# EAGLE design xjalad_arduino_v1.5 (EAGLE 6.4)
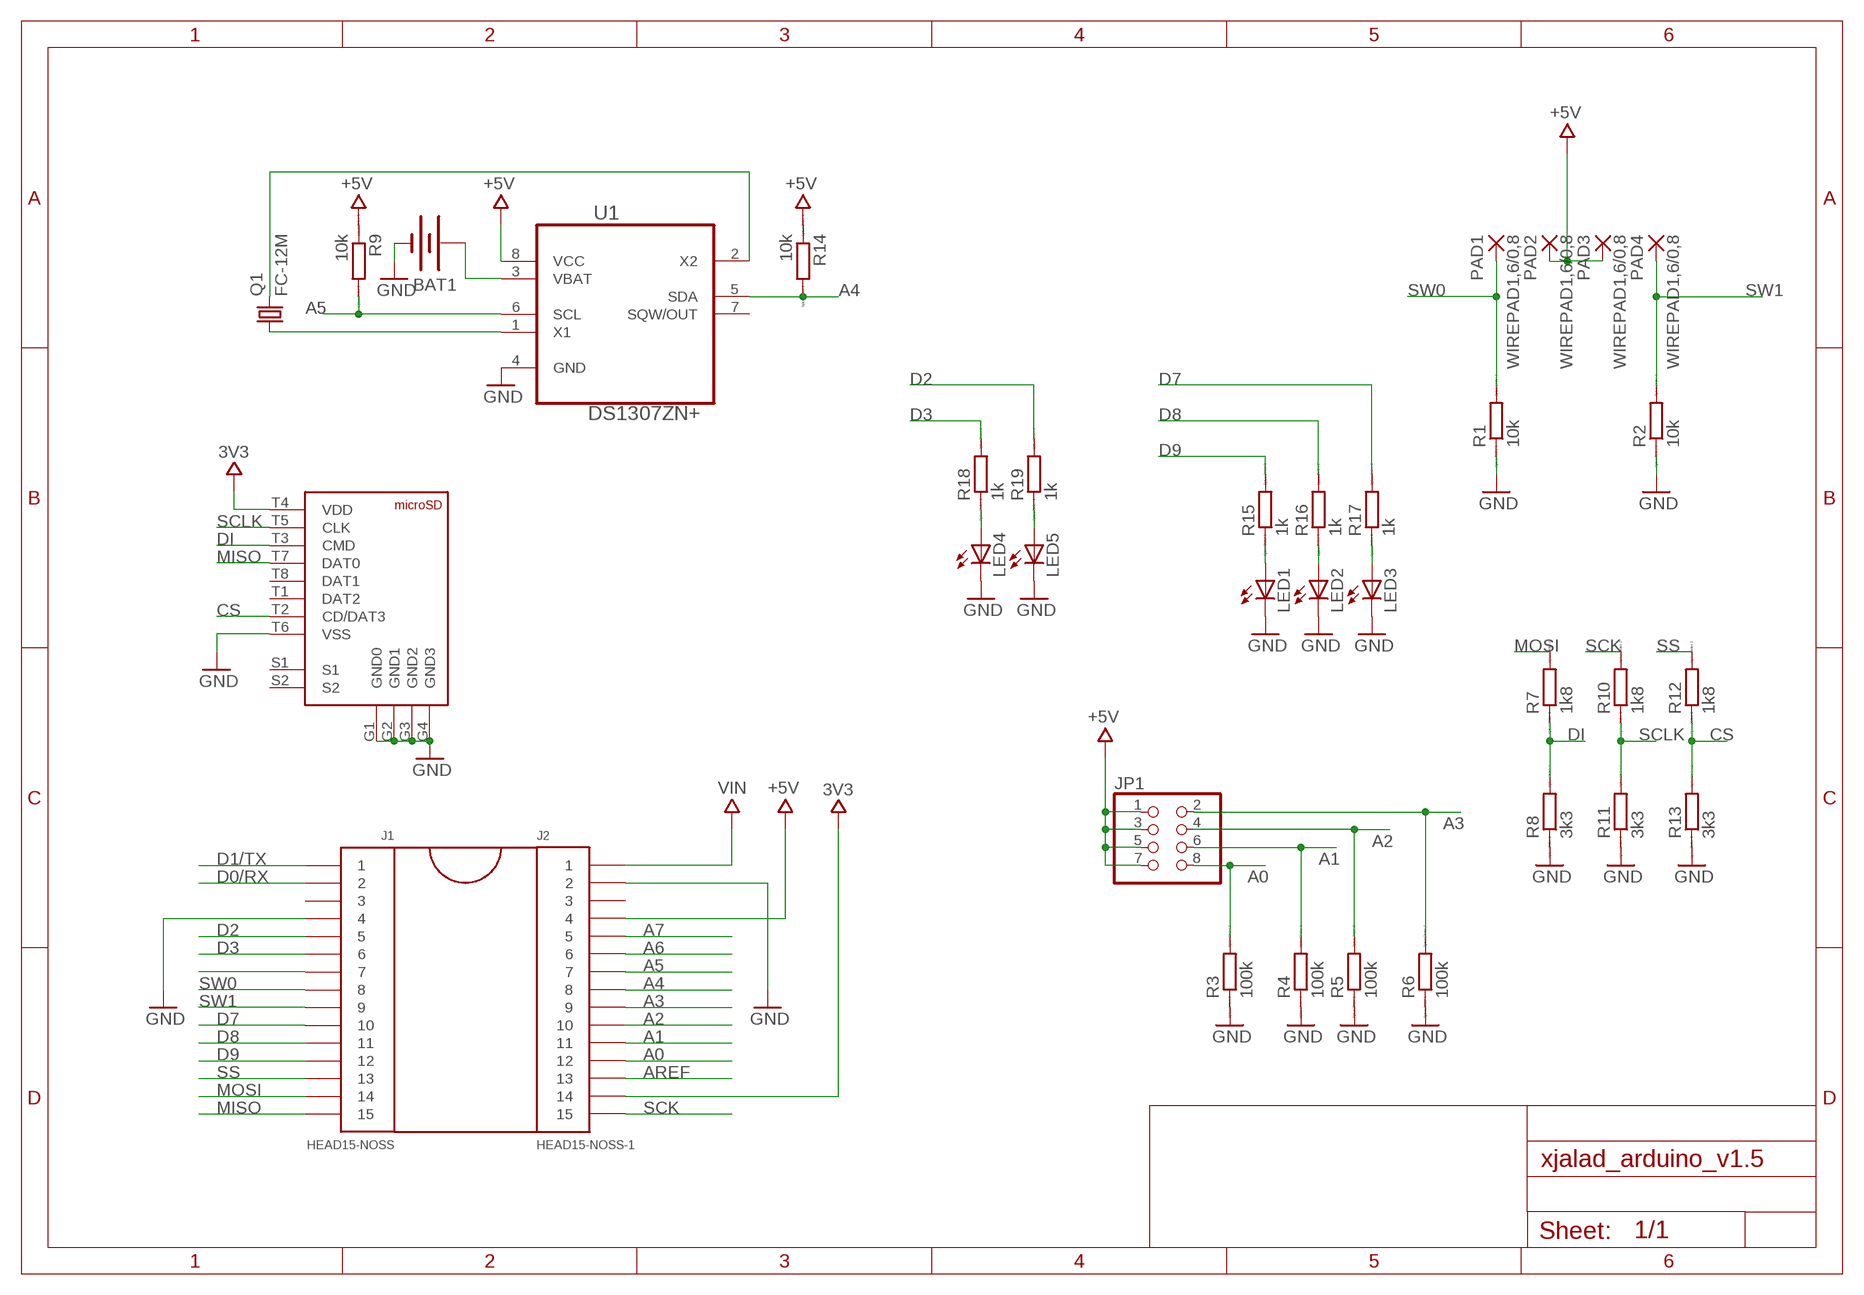
[diagram p0: schematic, sheet 1]

## Parts
BAT1  BATTERY12MM  [BATTCON_12MM]
J1  HEAD15-NOSS  [HEAD15-NOSS]
J2  HEAD15-NOSS-1  [HEAD15-NOSS-1]
J3  MICROSD_MOLEX  [MICROSD_104031]
JP1  PINHD-2X4  [2X04]
LED1  LED0603  [LED-0603]
LED2  LED0603  [LED-0603]
LED3  LED0603  [LED-0603]
LED4  LED0603  [LED-0603]
LED5  LED0603  [LED-0603]
PAD1  WIREPAD1,6/0,8  [1,6/0,8]
PAD2  WIREPAD1,6/0,8  [1,6/0,8]
PAD3  WIREPAD1,6/0,8  [1,6/0,8]
PAD4  WIREPAD1,6/0,8  [1,6/0,8]
Q1  FC-12M  [FC-12M]
R1  10k  RR0603  [R0603]
R2  10k  RR0603  [R0603]
R3  100k  RR0603  [R0603]
R4  100k  RR0603  [R0603]
R5  100k  RR0603  [R0603]
R6  100k  RR0603  [R0603]
R7  1k8  RR0603  [R0603]
R8  3k3  RR0603  [R0603]
R9  10k  RR0603  [R0603]
R10  1k8  RR0603  [R0603]
R11  3k3  RR0603  [R0603]
R12  1k8  RR0603  [R0603]
R13  3k3  RR0603  [R0603]
R14  10k  RR0603  [R0603]
R15  1k  RR0603  [R0603]
R16  1k  RR0603  [R0603]
R17  1k  RR0603  [R0603]
R18  1k  RR0603  [R0603]
R19  1k  RR0603  [R0603]
U1  DS1307ZN+  [SOIC127P600X175-8N]

## Nets
3V3: J2.14 J3.T4(VDD)
+5V: J2.4 JP1.1 JP1.3 JP1.5 JP1.7 PAD2.1(P) PAD3.1(P) R9.1 R14.1 U1.8(VCC)
A0: J2.12 JP1.8 R3.2
A1: J2.11 JP1.6 R4.2
A2: J2.10 JP1.4 R5.2
A3: J2.9 JP1.2 R6.2
A4: J2.8 R14.2 U1.5(SDA)
A5: J2.7 R9.2 U1.6(SCL)
A6: J2.6
A7: J2.5
AREF: J2.13
CS: J3.T2(CD/DAT3) R12.1 R13.2
D0/RX: J1.2
D1/TX: J1.1
D2: J1.5 R19.2
D3: J1.6 R18.2
D7: J1.10 R17.2
D8: J1.11 R16.2
D9: J1.12 R15.2
DI: J3.T3(CMD) R7.1 R8.2
GND: BAT1.GND(-) J1.4 J2.2 J3.G1(GND0) J3.G2(GND1) J3.G3(GND2) J3.G4(GND3) J3.T6(VSS) LED1.C LED2.C LED3.C LED4.C LED5.C R1.1 R2.1 R3.1 R4.1 R5.1 R6.1 R8.1 R11.1 R13.1 U1.4(GND)
MISO: J1.15 J3.T7(DAT0)
MOSI: J1.14 R7.2
N$1: Q1.1 U1.1(X1)
N$2: Q1.2 U1.2(X2)
N$3: LED1.A R15.1
N$4: BAT1.PWR@1(+) U1.3(VBAT)
N$5: LED2.A R16.1
N$6: LED3.A R17.1
N$7: LED4.A R18.1
N$8: LED5.A R19.1
N$11: J1.7
SCK: J2.15 R10.2
SCLK: J3.T5(CLK) R10.1 R11.2
SS: J1.13 R12.2
SW0: J1.8 PAD1.1(P) R1.2
SW1: J1.9 PAD4.1(P) R2.2
VIN: J2.1
Unconnected: J1.3 J2.3 J3.S1 J3.S2 J3.T1(DAT2) J3.T8(DAT1) U1.7(SQW/OUT)

## Library data of the parts
BAT1 = SparkFun:BATTERY: Battery Holders Various common sizes : AA, AAA, 20mm coin cell and 12mm coin cell.
J1 = MyCON2:HEAD15-NOSS
J2 = MyCON2:HEAD15-NOSS-1
J3 = NJC:MICROSD_MOLEX: Mouser Part #: 538-104031-0811 Manufacturer Part #: 104031-0811 Manufacturer: Molex Description: Memory Card Connectors MICRO SD PUSH-PULL SMT 1.42MM HEIGHT
JP1 = pinhead:PINHD-2X4: PIN HEADER
LED1-LED5 = SparkFun:LED: LEDs Standard schematic elements and footprints for 5mm, 3mm, 1206, and 0603 sized LEDs. 5mm - Spark Fun Electronics SKU : COM-00529 (and others)
PAD1-PAD4 = wirepad:WIREPAD: Wire PAD connect wire on PCB
Q1 = crystal:FC-12M: kHz RANGE CRYSTAL UNIT LOW PROFILE SMD Source: Epson Toyocom FC-12M.pdf
R1-R19 = eagle-ltspice:R: RESISTOR, European symbol; SPICEMODEL: NONE; SPICEPREFIX: R
U1 = soic8_max:DS1307ZN+: 64 x 8, Serial, I2C Real-Time Clock; MPN: DS1307ZN+; OC_FARNELL: 9725253; OC_NEWARK: 73J0081; PACKAGE: SOIC-8; SUPPLIER: Maxim

## Board
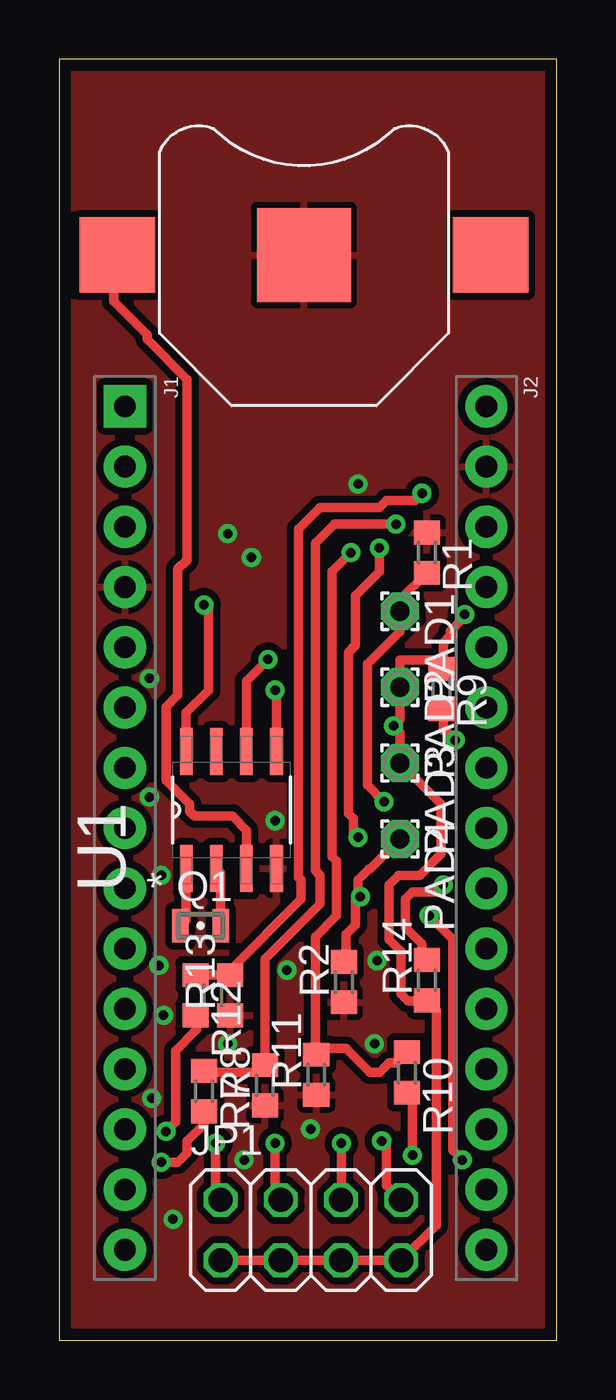
[diagram p1: board, top side]
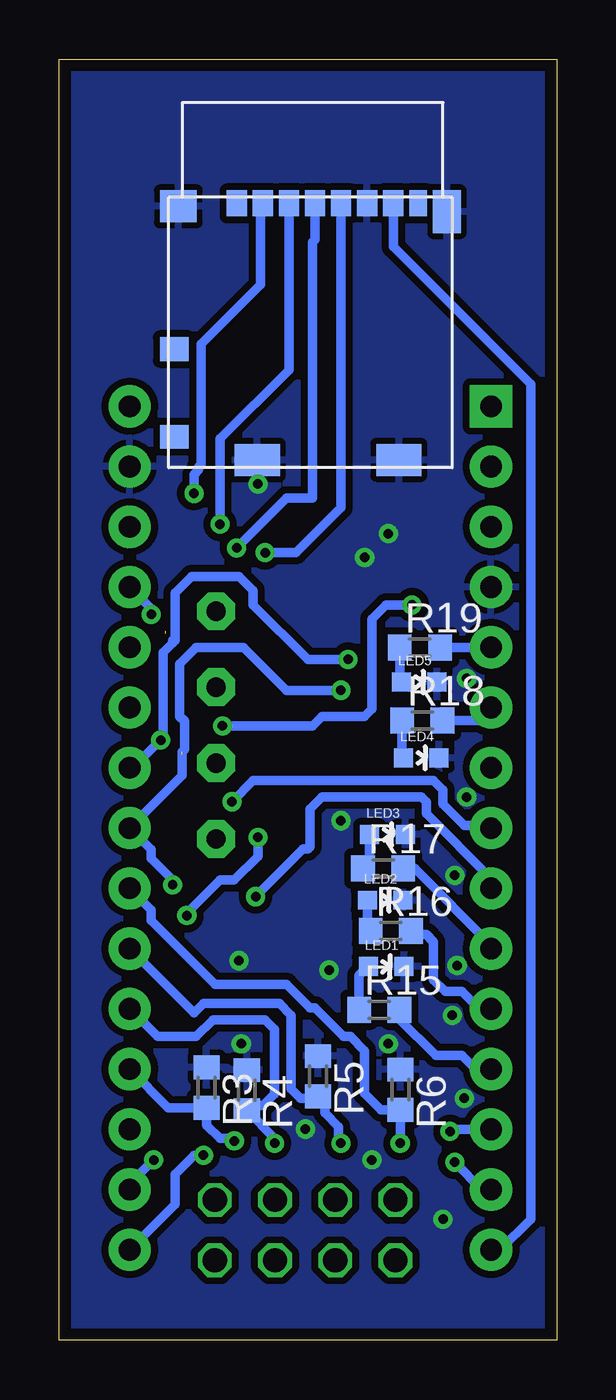
[diagram p2: board, bottom side, seen from below]

Size 20.98 x 54 mm. Coordinates in mm from the lower left corner, seen from the top.
Outline: 0,0 20.98,0 20.98,54 0,54 0,0
Copper layers (1*16): Top 0.035mm / dielectric 1.6mm / Bottom 0.035mm
Design rules "t2he_frees2 *": minimum track width 0.3mm, minimum drill 0.5mm, track to track 0.3mm, track to pad 0.3mm, pad to pad 0.3mm, via to via 0.3mm, smd to smd 0mil, copper to edge 0.5mm, drill to drill 0.5mm, minimum pad ring 8mil, minimum via ring 8mil, stop-mask expansion 4mil, vias tented up to drill 0mil, thermal gap 10mil

### Footprints (pad centres in the part's own frame; a part is rotated, then mirrored left to right if it is on the bottom)
BATTCON_12MM = smd 3.962 x 3.962: GND 0,0 | smd 3.175 x 3.175: PWR@1 -7.874,0; PWR@2 7.874,0
HEAD15-NOSS = drill 0.914 pad 1.778 square: 1 0,0 | drill 0.914 pad 1.778: 2 2.54,0; 3 5.08,0; 4 7.62,0; 5 10.16,0; 6 12.7,0; 7 15.24,0; 8 17.78,0; 9 20.32,0; 10 22.86,0; 11 25.4,0; 12 27.94,0; 13 30.48,0; 14 33.02,0; 15 35.56,0
HEAD15-NOSS-1 = drill 0.914 pad 1.778: 1 0,0; 2 2.54,0; 3 5.08,0; 4 7.62,0; 5 10.16,0; 6 12.7,0; 7 15.24,0; 8 17.78,0; 9 20.32,0; 10 22.86,0; 11 25.4,0; 12 27.94,0; 13 30.48,0; 14 33.02,0; 15 35.56,0
MICROSD_104031 = smd 1.55 x 1.35: G1 5.565,0.375 | smd 1.17 x 1.8: G2 -5.755,0.6 | smd 1.9 x 1.35: G3 -3.73,11.075; G4 2.24,11.075 | smd 1.2 x 1: S1 5.74,10.1; S2 5.74,6.4 | smd 0.85 x 1.1: T1 3.105,0.25; T2 2.005,0.25; T3 0.905,0.25; T4 -0.195,0.25; T5 -1.295,0.25; T6 -2.395,0.25; T7 -3.495,0.25 | smd 0.75 x 1.1: T8 -4.545,0.25
2X04 = drill 1.016 octagon: 1 -3.81,-1.27; 2 -3.81,1.27; 3 -1.27,-1.27; 4 -1.27,1.27; 5 1.27,-1.27; 6 1.27,1.27; 7 3.81,-1.27; 8 3.81,1.27
LED-0603 = smd 0.8 x 0.8: A 0,-0.75; C 0,0.75
1,6/0,8 = drill 0.813 pad 1.6 octagon: 1 0,0
FC-12M = smd 0.7 x 1.4: 1 -0.85,0; 2 0.85,0
R0603 = smd 1 x 1.1: 1 -0.85,0; 2 0.85,0
SOIC127P600X175-8N = smd 1.981 x 0.533: 1 -2.464,1.905; 2 -2.464,0.635; 3 -2.464,-0.635; 4 -2.464,-1.905; 5 2.464,-1.905; 6 2.464,-0.635; 7 2.464,0.635; 8 2.464,1.905

### Placement (x,y rotation side)
BAT1  10.32,45.75 0 top
J1  2.77,39.37 270 top
J2  18.01,39.37 270 top
J3  10.39,48.18 180 bottom
JP1  10.61,4.64 0 top
LED1  7.2,15.75 270 bottom
LED2  7.24,18.55 270 bottom
LED3  7.14,21.32 270 bottom
LED4  5.71,24.55 270 bottom
LED5  5.8,27.75 270 bottom
PAD1  14.37,30.73 270 top
PAD2  14.37,27.53 270 top
PAD3  14.37,24.33 270 top
PAD4  14.37,21.13 270 top
Q1  5.96,17.48 0 top
R1  15.5,33.2 270 top
R2  12,15.1 90 top
R3  14.76,10.65 270 bottom
R4  13.07,10.54 270 bottom
R5  10.06,11.13 270 bottom
R6  6.59,10.56 270 bottom
R7  6.11,10.5 270 top
R8  8.67,10.75 90 top
R9  16.11,27.46 270 top
R10  14.67,11.29 270 top
R11  10.84,11.19 90 top
R12  5.75,14.54 270 top
R13  7.2,14.54 90 top
R14  15.5,15.18 90 top
R15  7.48,13.93 0 bottom
R16  7,17.25 0 bottom
R17  7.32,19.89 0 bottom
R18  5.67,26.12 0 bottom
R19  5.77,29.2 0 bottom
U1  7.26,22.35 90 top

### Tracks (layer width: path | path; a pad name or v marks a point on that pad's centre or on a via)
3V3  (via drill 0.4 pad 0.3)
  Top 0.4: v13.5,33.4 13.5,32.4 12.5,31.4 12.5,29.3 12.2,29 12.2,22.2 12.4,22 12.4,21.4 v12.6,21.2 | v17,7.6 16.6,8 16.6,16.9 v15.6,17.9
  Bottom 0.4: J3.T4 10.2,46.41 10.3,46.3 10.3,35.5 11.4,35.5 v13.5,33.4 | v12.6,21.2 12.6,20.4 13.6,19.4 14.2,19.4 15.6,18 v15.6,17.9 | J2.14 18.01,6.59 v17,7.6
+5V  (via drill 0.4 pad 0.3)  (1 unrouted)
  Top 0.4: JP1.1 JP1.3 JP1.5 JP1.7 15.9,4.85 15.9,13.93 R14.1 15.47,14.3 14.7,14.3 14.4,14.6 14.4,16.4 13.9,16.9 13.9,19.2 14.3,19.6 15.2,19.6 16.1,20.5 16.1,22.6 PAD3.1 14.37,25.63 v14.1,25.9 14.37,26.17 PAD2.1 14.37,28.67 16.07,28.67 16.2,28.8 | v17.1,30.6 17.1,30.5 16.5,29.9 | 16.2,28.8 16.2,29.4 16.5,29.7 16.5,29.8 | 16.2,28.8 16.2,28.4 R9.1 | v6.1,31 6.3,30.8 6.3,27.4 5.36,26.45 U1.8
  Bottom 0.4: v17.1,30.6 17.1,30.84 J2.4 | v6.1,31 7.2,31 7.8,30.4 7.8,26.6 8.1,26.3 9.9,26.3 10.3,25.9 v14.1,25.9
A0  (via drill 0.4 pad 0.3)
  Top 0.4: JP1.8 13.8,6.53 13.8,8.2 v13.6,8.4
  Bottom 0.4: J2.12 16.38,9.8 R3.2 14.76,9.06 14.2,8.5 13.7,8.5 v13.6,8.4
A1  (via drill 0.4 pad 0.3)
  Top 0.4: v11.9,8.3 11.9,5.93 JP1.6
  Bottom 0.4: v11.9,8.3 11.87,8.33 11.87,8.49 R4.2 12.86,9.9 12.38,9.9 11.9,10.38 11.9,13.1 12.3,13.5 14.5,13.5 15.2,12.8 16.84,12.8 J2.11
A2  (via drill 0.4 pad 0.3)
  Top 0.4: v9.1,8.3 9.1,6.15 JP1.4
  Bottom 0.4: 9.16,8.36 v9.1,8.3 9.2,8.4 9.2,9 9.78,9.58 9.78,10.2 10.14,10.2 | J2.10 15.3,13.8 14.9,14.2 11.7,14.2 11.2,13.7 11.2,10.6 10.8,10.2 10.6,10.2 10.14,10.2 | 10.14,10.2 R5.2
A3  (via drill 0.4 pad 0.3)
  Top 0.4: v6.6,8.3 6.6,6.11 JP1.2
  Bottom 0.4: v6.6,8.3 v6.59,8.31 R6.2 7.41,9.71 8.1,10.4 8.1,12.2 8.7,12.8 9,12.8 10.2,14 10.4,14 11.4,15 14.4,15 17.1,17.7 17.1,18.14 J2.9
A4  (via drill 0.4 pad 0.3)  (1 unrouted)
  Top 0.4: U1.5 9.16,27.34 v9.1,27.4 | v16.2,19.2 15.9,18.9 14.9,18.9 14.6,18.6 14.6,17.4 15.3,16.7 15.3,16.23 R14.2
  Bottom 0.4: v9.1,27.4 11.4,27.4 13.2,29.2 15.2,29.2 15.9,28.5 15.9,26.3 15.7,26.1 15.7,24.9 15.8,24.8 | v16.2,19.2 16.2,19.4 17.1,20.3 17.1,20.68 J2.8 15.8,23.8 15.8,24.7
A5  (via drill 0.4 pad 0.3)
  Top 0.4: U1.6 7.89,27.8 v8.8,28.7 | R9.2 16.2,26.52 16.2,25.7 16.3,25.7 v16.7,25.3
  Bottom 0.4: v8.8,28.7 10.5,28.7 12.8,31 12.8,31.6 13.4,32.2 15.4,32.2 16.1,31.5 16.1,29.5 16.2,29.5 16.2,29.4 16.6,29 16.6,25.4 v16.7,25.3 17.67,24.33 17.67,24.13 J2.7
CS  (via drill 0.4 pad 0.3)
  Top 0.4: R12.1 R13.2 7.2,15.6 10.2,18.6 10.2,19.4 10.1,19.5 10.1,34.2 11,35.1 13.5,35.1 13.8,35.4 15,35.4 v15.3,35.7 15.1,35.5
  Bottom 0.4: v15.3,35.7 15.3,36.5 15.1,36.7 15.1,36.8 15,36.9 15,42 12.5,44.5 12.5,47.83 J3.T2
D2
  Bottom 0.4: R19.2 J1.5
D3
  Bottom 0.4: R18.2 3.32,26.12 J1.6
D7
  Bottom 0.4: J1.10 2.77,16.67 5.99,19.89 R17.2
D8
  Bottom 0.4: R16.2 6,17.1 5.5,17.1 5.2,16.8 5.2,15.2 4.7,14.7 4,14.7 3.27,13.97 J1.11
D9
  Bottom 0.4: J1.12 3.43,11.43 4,12 5.1,12 6.63,13.53 R15.2
DI  (via drill 0.4 pad 0.3)
  Top 0.4: R7.1 6.16,11.3 8.37,11.3 R8.2 8.67,16.07 11,18.4 11,19.6 10.8,19.8 10.8,33.6 11.6,34.4 v14.2,34.4
  Bottom 0.4: J3.T3 11.29,40.91 14.2,38 v14.2,34.4
GND  (via drill 0.4 pad 0.3)
  other vias: 4.4,13.7 7.1,34 8.1,33 10.6,8.9 12.6,36.1 3.8,27.9 3.8,22.9 4.3,19.6 4.2,15.8 7.1,12.5 7.8,7.6 4.8,5.1 9.1,21.9 9.6,15.6 13.3,12.5 13.4,16 3.9,10.2
  pour Bottom: 0,54 21,54 21,0 0,0
  pour Top: 0,54 21,54 21,0 0,0
MISO
  Bottom 0.4: J1.15 2.39,3.81 1.1,5.1 1.1,40.3 6.89,46.09 J3.T7
MOSI  (via drill 0.4 pad 0.3)
  Top 0.4: 5.91,9.65 R7.2 6.1,9.1 5.4,8.4 5.4,7.9 5,7.5 v4.3,7.5
  Bottom 0.4: J1.14 3.15,6.35 v4.3,7.5
N$1
  Top 0.4: U1.1 5.36,17.73 Q1.1
N$2
  Top 0.4: Q1.2 6.81,19.7 U1.2
N$3
  Bottom 0.4: R15.1 8.33,15.37 LED1.A
N$4
  Top 0.4: BAT1.PWR@1 2.3,45.6 2.3,43.8 3.7,42.4 3.7,42.2 5.4,40.5 5.4,32.9 5,32.5 5,27.2 4.5,26.7 4.5,23.6 5.5,22.6 5.5,22.3 5.7,22.1 7.3,22.1 7.9,21.5 U1.3
N$5
  Bottom 0.4: LED2.A 7.99,17.39 R16.1
N$6
  Bottom 0.4: LED3.A 7.89,20.17 R17.1
N$7
  Bottom 0.4: R18.1 6.52,24.61 LED4.A
N$8
  Bottom 0.4: R19.1 6.62,27.82 LED5.A
SCK  (via drill 0.4 pad 0.3)
  Top 0.4: R10.2 14.9,10.21 v14.9,7.8
  Bottom 0.4: J2.15 16.1,5.72 16.1,7 15.3,7.8 v14.9,7.8
SCLK  (via drill 0.4 pad 0.3)
  Top 0.4: v12.3,33.2 11.5,32.4 11.5,20.4 11.7,20.2 11.7,17.9 10.8,17 10.8,12.08 R11.2 11.1,12.3 12.1,12.3 13.1,11.3 13.5,11.3 13.9,11.7 14.23,11.7 R10.1
  Bottom 0.4: J3.T5 9.1,35.1 11,33.2 v12.3,33.2
SS  (via drill 0.4 pad 0.3)
  Top 0.4: v4.5,8.8 4.9,9.2 4.9,12.2 5.8,13.1 5.8,13.64 R12.2
  Bottom 0.4: J1.13 4.41,8.89 v4.5,8.8
SW0  (via drill 0.4 pad 0.3)
  Top 0.4: v13.7,22.7 13,23.4 13,28.5 14.37,29.87 PAD1.1 14.37,31.22 R1.2
  Bottom 0.4: 3.19,21.59 J1.8 2.88,21.7 3.9,21.7 4.8,22.6 4.8,23.2 5.2,23.6 12.8,23.6 v13.7,22.7
SW1  (via drill 0.4 pad 0.3)
  Top 0.4: PAD4.1 13.1,19.86 13.06,19.86 12.6,19.4 12.6,18.8 v12.7,18.7 12.5,18.5 12.5,17.5 12.1,17.1 12.1,16.05 R2.2
  Bottom 0.4: J1.9 2.77,19.47 5.5,22.2 5.5,22.7 5.7,22.9 9.9,22.9 10.4,22.4 10.4,20.8 10.5,20.7 10.7,20.7 v12.7,18.7